# Altium project opamp.PrjPcb
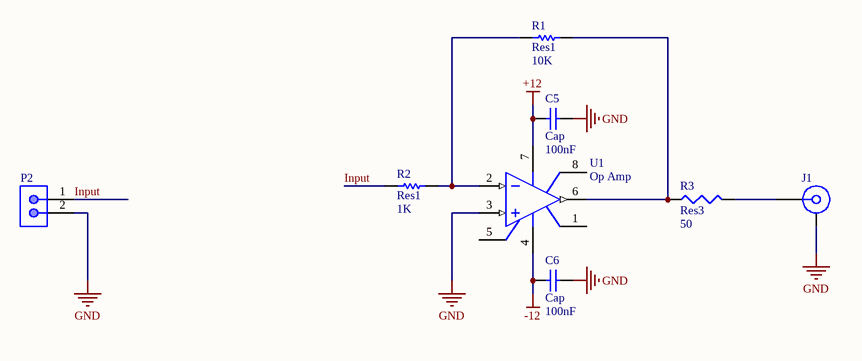
[diagram p0: opamp.SchDoc]
2 sheets, 13 parts. Net scope: global (net labels, ports and power ports of the same name join across sheets).
Board file: PCB1.PcbDoc
Sheets:
  opamp.SchDoc
  power.SchDoc

## Sheet opamp.SchDoc
size A4

### Parts
C5  Cap  value 100nF  [RAD-0.3]
C6  Cap  value 100nF  [RAD-0.3]
J1  51K204-400A5  [ROS-51K204-400A5_V]  (value not drawn)
P2  22-27-2021  [MOLX-22-27-2021_V]  (value not drawn)
R1  Res1  value 10K  [AXIAL-0.3]
R2  Res1  value 1K  [AXIAL-0.3]
R3  Res3  value 50  [J1-0603]
U1  Op Amp  [DIP-8]

### Nets
+12: C5.2 U1.7(V+)
-12: C6.2 U1.4(V-)
GND: C5.1 C6.1 J1.MH P2.2 U1.3(IN+)
Input: P2.1 R2.1
NetJ1_1: J1.1 R3.2
NetR1_1: R1.1 R2.2 U1.2(IN-)
NetR1_2: R1.2 R3.1 U1.6(OUT)

Not connected (* = marked no-connect by the designer): U1 1(OS_NUL) 5(OS_NUL) 8(TAB)

### Library data of the parts
C5 C6 = Cap: Capacitor; Published: 8-Jun-2000; LatestRevisionDate: 17-Jul-2002; LatestRevisionNote: Re-released for DXP Platform.; PackageReference: RAD-0.3; Publisher: Altium Limited; PackageDescription: Radial Cap, Thru-Hole; 2 Leads; 0.3 in Pin Spacing
J1 = CMP-0753-00004-1: BNC 50R Right Angle Jack, Panel Feedthrough, Up to 10 GHz, -55 to 155 degC; Manufacturer: Rosenberger; Design Note: Footprint in library is a generic example - only application specific footprint delivers High Performance; PartNumber: 51K204-400A5; PackageReference: 51K204-400A5; DatasheetVersion: d00; ComponentLink2Description: Datasheet; ComponentLink5Description: Webshop / RFQ; ComponentLink1URL: http://www.rosenberger.de; ComponentLink4URL: http://rosenberger.de/ok/images/documents/spez/51.pdf; PackageVersion: d00; ComponentLink5URL: http://www.rosenberger.com/en/contact/sales/; ComponentLink3URL: http://rosenberger.de/ok/images/documents/db/51K204-400A5.pdf; ComponentLink2URL: http://rosenberger.de/ok/images/documents/db/51K204-400A5.pdf; ComponentLink1Description: Manufacturer URL; Mounting Technology: Through Hole; PackageDescription: 50R BNC Right Angle Jack, 12.5 x 32.6 x 14.5 mm; ComponentLink4Description: Series Overview / Design Note; ComponentLink3Description: Package Specification
P2 = CMP-2000-05537-1: Male Header, Pitch 2.54 mm, 1 x 2 Position, Height 11.7 mm, Tail Length 3.56 mm, 0 to 75 degC, RoHS, Bulk; Manufacturer: Molex; PartNumber: 0022272021; Current rating: 4A; Package Version: Rev. BC, 02/2012; Voltage rating: 250V; No. of Positions: 2; Pitch: 2.54mm; No. of Rows: 1; Orientation: Vertical; Operating temperature: 0°Cto+75°C; Manufacturer URL: http://www.molex.com/; Mounting Technology: ThroughHole; Housing material: Nylon(UL94V-0); Package Description: 2-Leads Header, Body 5.08 x 5.8 mm, Pitch 2.54 mm; Voltage - Max: 250V; Datasheet URL: http://www.molex.com/pdm_docs/sd/022272021_sd.pdf; Package Reference: 22-27-2021; Contact material: Tinplatedbrass; Current - Max: 4A; Datasheet Version: Rev. F, 06/2009
R1 R2 = Res1: Resistor; Published: 8-Jun-2000; LatestRevisionDate: 17-Jul-2002; LatestRevisionNote: Re-released for DXP Platform.; PackageReference: AXIAL-0.3; Publisher: Altium Limited; PackageDescription: Axial Device, Thru-Hole; 2 Leads; 0.3 in Pin Spacing
R3 = Res3: Resistor; Published: 8-Jun-2000; LatestRevisionDate: 29-May-2009; LatestRevisionNote: IPC-7351 Footprint Added.; PackageReference: J1-0603; Publisher: Altium Limited; PackageDescription: Chip Resistor
U1 = Op Amp: FET Operational Amplifier; Published: 8-Jun-2000; LatestRevisionDate: 17-Jul-2002; LatestRevisionNote: Re-released for DXP Platform.; DatasheetVersion: REV. B; PackageVersion: 1990; PackageReference: H-08A; Publisher: Altium Limited; PackageDescription: Can; 8 Leads; Pin Circle Dia. 5.08 mm; Lead Dia. 0.53 mm (max); ComponentLink1Description: Manufacturer Link; ComponentLink1URL: http://www.analog.com/

## Sheet power.SchDoc
size Letter
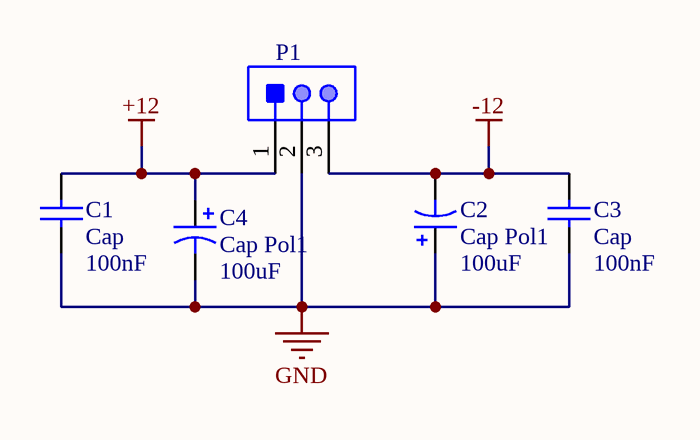
[diagram p1: power.SchDoc]

### Parts
C1  Cap  value 100nF  [RAD-0.3]
C2  Cap Pol1  value 100uF  [RB7.6-15]
C3  Cap  value 100nF  [RAD-0.3]
C4  Cap Pol1  value 100uF  [RB7.6-15]
P1  171825-3  [TECO-171825-3_V]  (value not drawn)

### Nets
+12: C1.2 C4.1 P1.1
-12: C2.2 C3.2 P1.3
GND: C1.1 C2.1 C3.1 C4.2 P1.2

### Library data of the parts
C1 C3 = Cap: Capacitor; Published: 8-Jun-2000; LatestRevisionDate: 17-Jul-2002; LatestRevisionNote: Re-released for DXP Platform.; PackageReference: RAD-0.3; Publisher: Altium Limited; PackageDescription: Radial Cap, Thru-Hole; 2 Leads; 0.3 in Pin Spacing
C2 C4 = Cap Pol1: Polarized Capacitor (Radial); Published: 8-Jun-2000; LatestRevisionDate: 17-Jul-2002; LatestRevisionNote: Re-released for DXP Platform.; PackageReference: RB7.6-15; Publisher: Altium Limited; PackageDescription: Polarized Capacitor (Radial); 2 Leads
P1 = CMP-2000-07494-1: Male Header, Pitch 2.5 mm, 1 x 3 Position, Height 10.4 mm, Tail Length 3.6 mm, / -20 to 95 degC / , RoHS, Bulk; Manufacturer: TE Connectivity; Mating Alignment: Yes(With); Tail Length: 0.142inch; Mating Post Length: 7.5mm; PCB Thickness: 0.063inch; PCB Mount Alignment: No(Without); Voltage Rating: 350V; Max Voltage Rating (AC): 250V; Plating Thickness: 0.8um; PCB Mounting Orientation: Vertical; Number of Positions: 3; PCB Mount Retention: Without; Max Current Rating: 3.5A; Max Voltage Rating (DC): 350.25kV; Pitch: 2.5mm; Approvals: UL; Contact Resistance: 20mOhm; Mount: ThroughHole; Length: 7.5mm; Orientation: Straight; Contact Mating Length: 0.295inch; Contact Material: Brass; Housing Material: Nylon; Package Description: Male Header, Pitch 2.5 mm, 1 x 3 Position, Height 10.4 mm, Tail Length 3.6 mm; Colour: Natural; Backwall/Post Interruptions: No(Without); Min Operating Temperature: -20degC; Mating Retention: Yes(With); Connector Type: Header; Packaging: Bag; RoHSCompliant: True; Package Reference: 171825-3; Contact Shape: Square; Strain Relief: No(Without); Contact Gender: Male; Number of Contacts: 3; Manufacturer URL: http://www.te.com/; Height: 0.409inch; Contact Retention: No(Without); Datasheet Version: Rev. Y3, 12/2016; Panel Mount Retention: No(Without); Datasheet URL: http://www.te.com/commerce/DocumentDelivery/DDEController?Action=showdoc&DocId=Customer+Drawing%7F171825%7FY3%7Fpdf%7FEnglish%7FENG_CD_171825_Y3.pdf%7F171825-3; Termination: Solder; Mounting Technology: ThroughHole; Max Operating Temperature: 95degC; Flammability Rating: UL94V-0; REACH SVHC: NoSVHC; Housing Colour: Natural; Package Quantity: 1000; Number of Rows: 1; Depth: 4.9mm; Contact Plating: Tin

## Nets that join several sheets
+12: opamp (C5.2 U1.7), power (C1.2 C4.1 P1.1)
-12: opamp (C6.2 U1.4), power (C2.2 C3.2 P1.3)
GND: opamp (5 pins), power (5 pins)